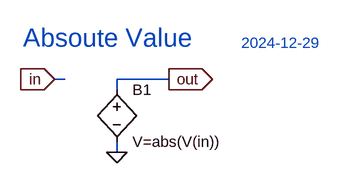
[diagram p0: schematic ABS.asc]
ABS.asc, the LTspice schematic file:
Version 4
SHEET 1 880 680
WIRE 80 128 64 128
WIRE 240 128 160 128
WIRE 160 144 160 128
WIRE 160 240 160 224
FLAG 64 128 in
IOPIN 64 128 In
FLAG 160 240 0
FLAG 240 128 out
IOPIN 240 128 Out
SYMBOL bv 160 128 R0
SYMATTR InstName B1
SYMATTR Value V=abs(V(in))
TEXT 16 64 Left 4 ;Absoute Value
TEXT 352 72 Left 2 ;2024-12-29

The netlist it stands for:
* ABS.asc
B1 out 0 V=abs(V(in))
* Absoute Value
* 2024-12-29
.backanno
.end